# EAGLE schematic MOD-v2-3a (EAGLE 8.3.1)
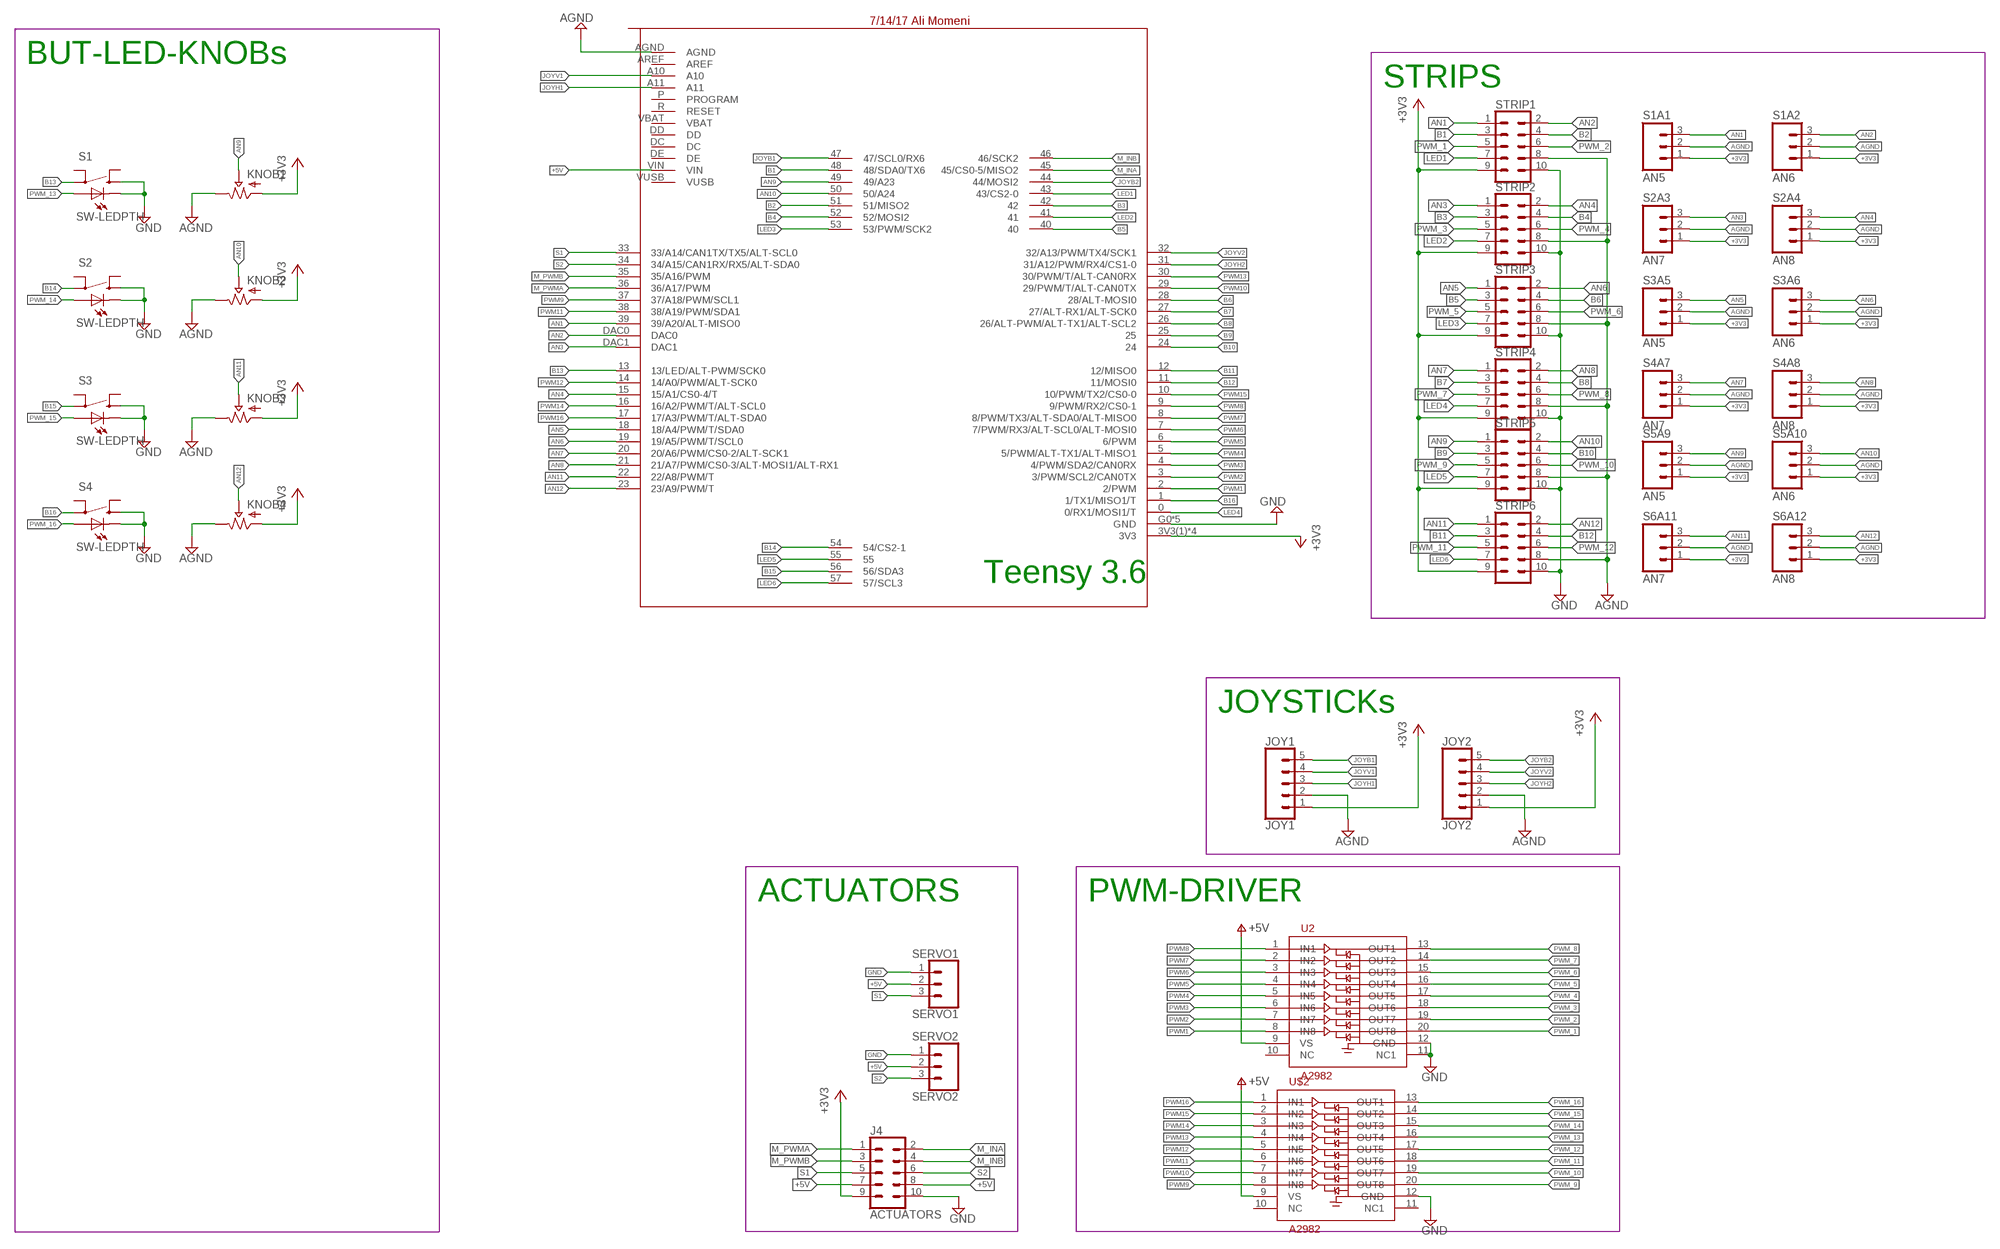
[diagram p0: schematic, sheet 1, part 1 of 2]
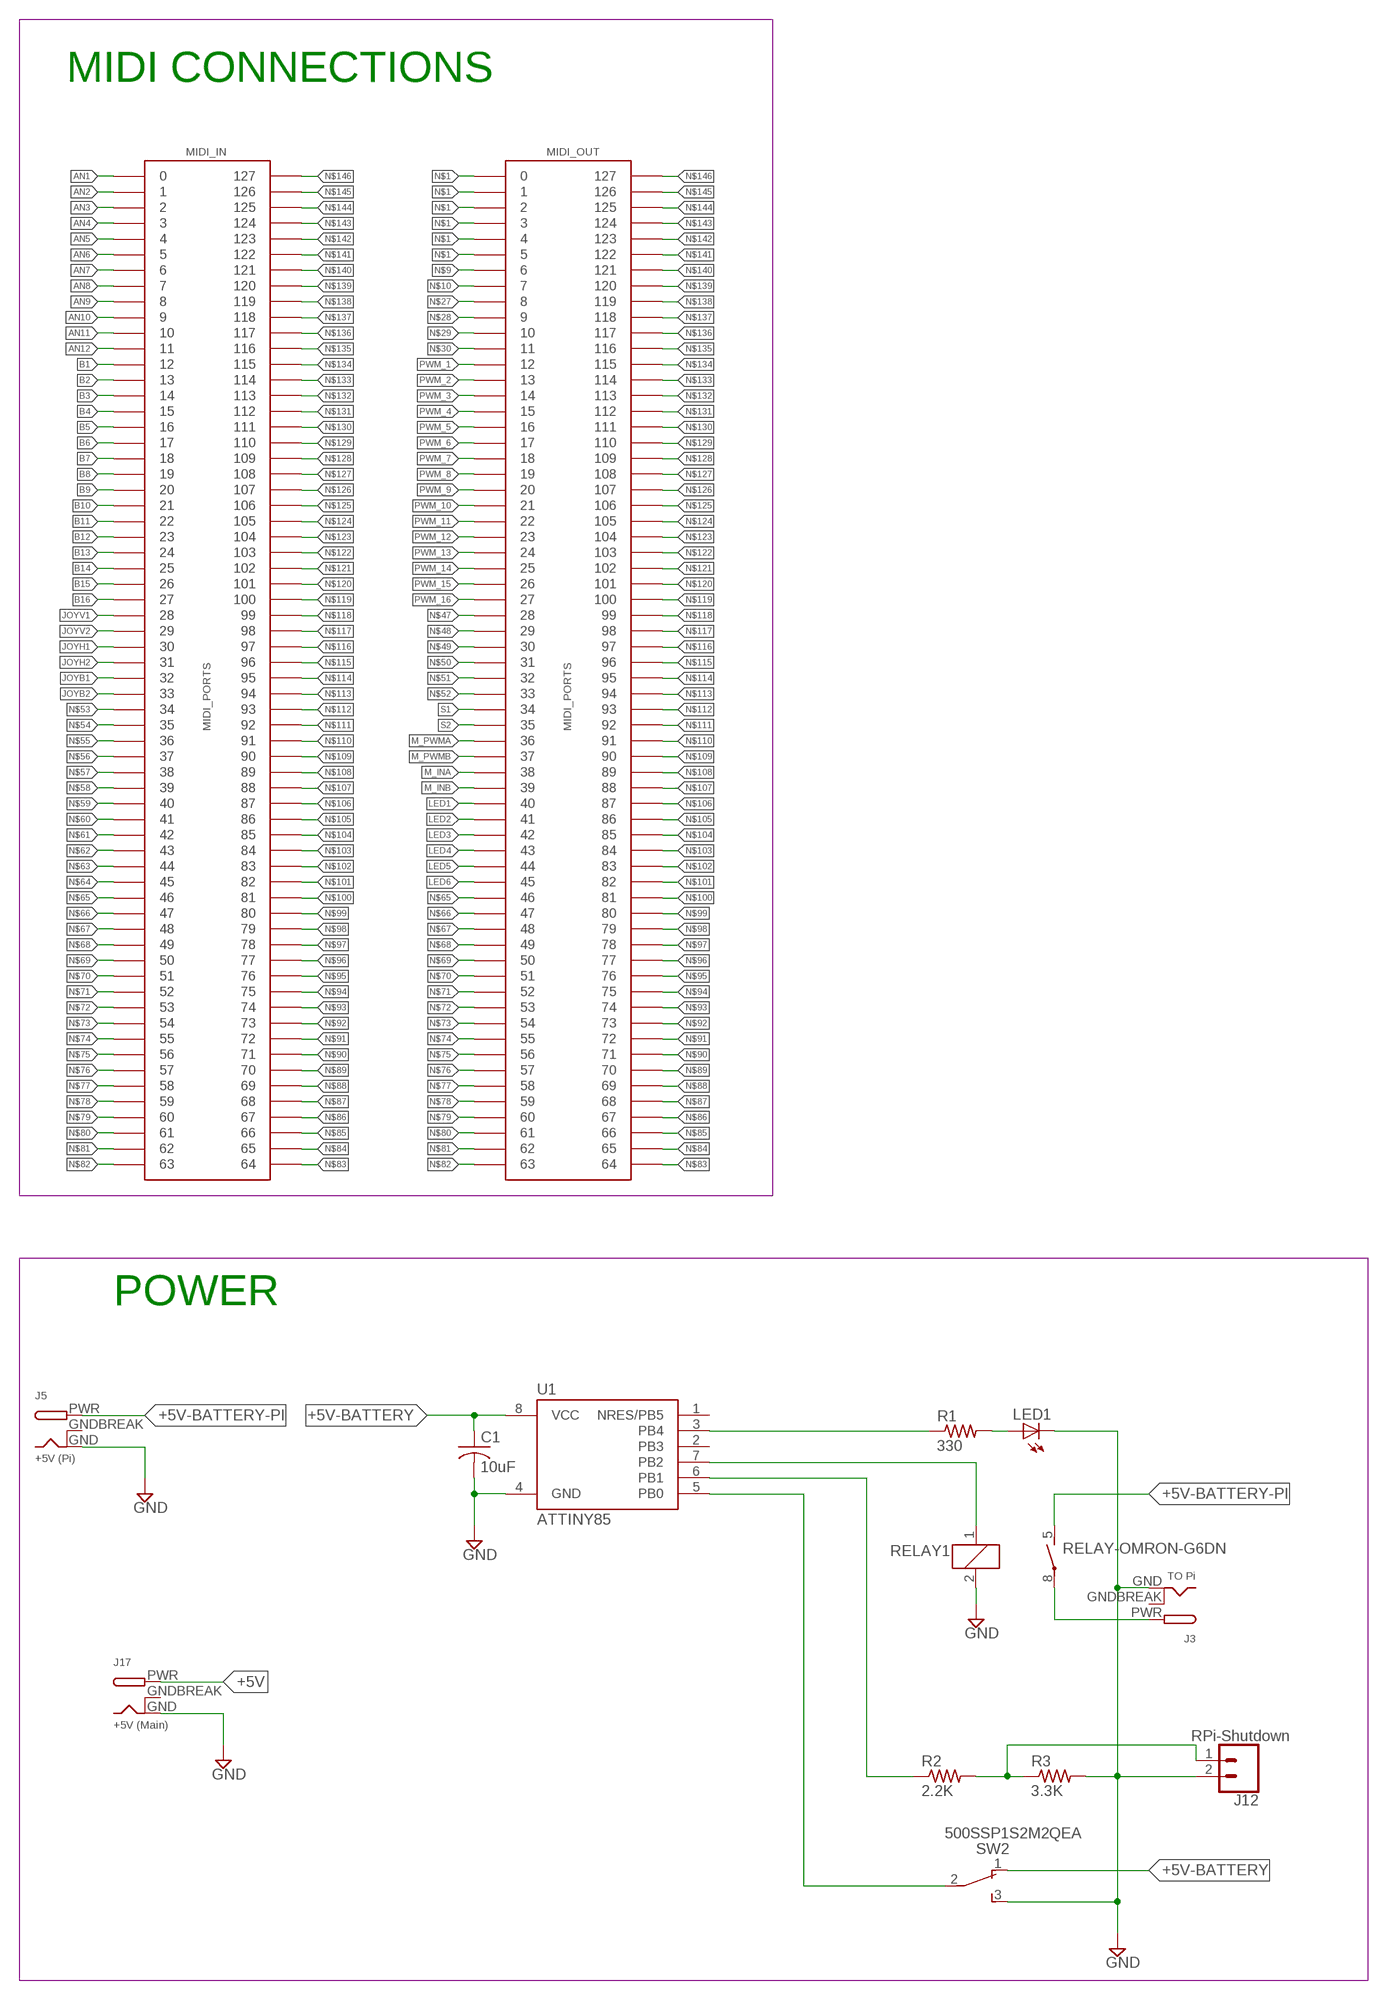
[diagram p1: schematic, sheet 1, part 2 of 2]

## Parts
C1  10uF  C-USC0805  [C0805]
J3  TO Pi  DCBARRELPTH  [DCJACK_2MM_PTH]
J4  ACTUATORS  CONN_05X2SHD_LOCK  [2X5-SHROUDED_LOCK]
J5  +5V (Pi)  DCBARRELPTH  [DCJACK_2MM_PTH]
J12  RPi-Shutdown  CONN_02LOCK  [1X02_LOCK]
J17  +5V (Main)  DCBARRELPTH  [DCJACK_2MM_PTH]
JOY1  JOY1  CONN_05LOCK  [1X05_LOCK]
JOY2  JOY2  CONN_05LOCK  [1X05_LOCK]
KNOB1  POTALPHA_RD901  [POT_ALPHA_RD901F-40-(L)R1]
KNOB2  POTALPHA_RD901  [POT_ALPHA_RD901F-40-(L)R1]
KNOB3  POTALPHA_RD901  [POT_ALPHA_RD901F-40-(L)R1]
KNOB4  POTALPHA_RD901  [POT_ALPHA_RD901F-40-(L)R1]
LED1  LED3MM  [LED3MM]
MIDI_IN  MIDI_PORTS  (no package)
MIDI_OUT  MIDI_PORTS  (no package)
R1  330  R-US_M0805  [M0805]
R2  2.2K  R-US_M0805  [M0805]
R3  3.3K  R-US_M0805  [M0805]
RELAY1  RELAY-OMRON-G6DN  [G6DN-1A]
S1  SW-LEDPTH  [SWITCH_TR2-MOMENTARY-LED]
S1A1  AN5  M03LOCK  [1X03_LOCK]
S1A2  AN6  M03LOCK  [1X03_LOCK]
S2  SW-LEDPTH  [SWITCH_TR2-MOMENTARY-LED]
S2A3  AN7  M03LOCK  [1X03_LOCK]
S2A4  AN8  M03LOCK  [1X03_LOCK]
S3  SW-LEDPTH  [SWITCH_TR2-MOMENTARY-LED]
S3A5  AN5  M03LOCK  [1X03_LOCK]
S3A6  AN6  M03LOCK  [1X03_LOCK]
S4  SW-LEDPTH  [SWITCH_TR2-MOMENTARY-LED]
S4A7  AN7  M03LOCK  [1X03_LOCK]
S4A8  AN8  M03LOCK  [1X03_LOCK]
S5A9  AN5  M03LOCK  [1X03_LOCK]
S5A10  AN6  M03LOCK  [1X03_LOCK]
S6A11  AN7  M03LOCK  [1X03_LOCK]
S6A12  AN8  M03LOCK  [1X03_LOCK]
SERVO1  SERVO1  CONN_03LOCK  [1X03_LOCK@1]
SERVO2  SERVO2  CONN_03LOCK  [1X03_LOCK@1]
STRIP1  CONN_05X2SHD_LOCK  [2X5-SHROUDED_LOCK]
STRIP2  CONN_05X2SHD_LOCK  [2X5-SHROUDED_LOCK]
STRIP3  CONN_05X2SHD_LOCK  [2X5-SHROUDED_LOCK]
STRIP4  CONN_05X2SHD_LOCK  [2X5-SHROUDED_LOCK]
STRIP5  CONN_05X2SHD_LOCK  [2X5-SHROUDED_LOCK]
STRIP6  CONN_05X2SHD_LOCK  [2X5-SHROUDED_LOCK]
SW2  500SSP1S2M2QEA  SWITCH_SPDT500SSP1S2M2QEA  [SWITCH_SPDT_500SSP1S2M2QEA]
TEENSY  TEENSY3_6-ALI_NO-USB-HOST  [TEENSY3-6_NO-USB-HOST]
U1  ATTINY85  ATTINY85SU  [ATTINY85]
U2  A2982  [SOIC20]
U$2  A2982  [SOIC20]

## Nets
+3V3: J4.9 JOY1.1 JOY2.1 KNOB1.1(IN) KNOB2.1(IN) KNOB3.1(IN) KNOB4.1(IN) S1A1.1 S1A2.1 S2A3.1 S2A4.1 S3A5.1 S3A6.1 S4A7.1 S4A8.1 S5A9.1 S5A10.1 S6A11.1 S6A12.1 STRIP1.9 STRIP2.9 STRIP3.9 STRIP4.9 STRIP5.9 STRIP6.9 TEENSY.3V3(1)(3V3) TEENSY.3V3(2)(3V3) TEENSY.3V3(3)(3V3) TEENSY.3V3(4)(3V3)
+5V [Power]: J4.7 J4.8 J17.PWR R1.1 SERVO1.2 SERVO2.2 TEENSY.VIN U1.3(PB4) U2.9(VS) U$2.9(VS) ; supply symbol labelled V+
+5V-BATTERY: C1.1 SW2.1 U1.8(VCC)
+5V-BATTERY-PI: J5.PWR RELAY1.5
AGND [Analog Sig]: JOY1.2 JOY2.2 KNOB1.3(OUT) KNOB2.3(OUT) KNOB3.3(OUT) KNOB4.3(OUT) S1A1.2 S1A2.2 S2A3.2 S2A4.2 S3A5.2 S3A6.2 S4A7.2 S4A8.2 S5A9.2 S5A10.2 S6A11.2 S6A12.2 STRIP1.8 STRIP2.8 STRIP3.8 STRIP4.8 STRIP5.8 STRIP6.8 TEENSY.AGND
AN1 [Analog Sig]: MIDI_IN.0 S1A1.3 STRIP1.1 TEENSY.39(39/A20/ALT-MISO0)
AN2 [Analog Sig]: MIDI_IN.1 S1A2.3 STRIP1.2 TEENSY.DAC0
AN3 [Analog Sig]: MIDI_IN.2 S2A3.3 STRIP2.1 TEENSY.DAC1
AN4 [Analog Sig]: MIDI_IN.3 S2A4.3 STRIP2.2 TEENSY.15(15/A1/CS0-4/T)
AN5 [Analog Sig]: MIDI_IN.4 S3A5.3 STRIP3.1 TEENSY.18(18/A4/PWM/T/SDA0)
AN6 [Analog Sig]: MIDI_IN.5 S3A6.3 STRIP3.2 TEENSY.19(19/A5/PWM/T/SCL0)
AN7 [Analog Sig]: MIDI_IN.6 S4A7.3 STRIP4.1 TEENSY.20(20/A6/PWM/CS0-2/ALT-SCK1)
AN8 [Analog Sig]: MIDI_IN.7 S4A8.3 STRIP4.2 TEENSY.21(21/A7/PWM/CS0-3/ALT-MOSI1/ALT-RX1)
AN9 [Analog Sig]: KNOB1.2(WIPER) MIDI_IN.8 S5A9.3 STRIP5.1 TEENSY.49(49/A23)
AN10 [Analog Sig]: KNOB2.2(WIPER) MIDI_IN.9 S5A10.3 STRIP5.2 TEENSY.50(50/A24)
AN11 [Analog Sig]: KNOB3.2(WIPER) MIDI_IN.10 S6A11.3 STRIP6.1 TEENSY.22(22/A8/PWM/T)
AN12 [Analog Sig]: KNOB4.2(WIPER) MIDI_IN.11 S6A12.3 STRIP6.2 TEENSY.23(23/A9/PWM/T)
B1: MIDI_IN.12 STRIP1.3 TEENSY.48(48/SDA0/TX6)
B2: MIDI_IN.13 STRIP1.4 TEENSY.51(51/MISO2)
B3: MIDI_IN.14 STRIP2.3 TEENSY.42
B4: MIDI_IN.15 STRIP2.4 TEENSY.52(52/MOSI2)
B5: MIDI_IN.16 STRIP3.3 TEENSY.40
B6: MIDI_IN.17 STRIP3.4 TEENSY.28(28/ALT-MOSI0)
B7: MIDI_IN.18 STRIP4.3 TEENSY.27(27/ALT-RX1/ALT-SCK0)
B8: MIDI_IN.19 STRIP4.4 TEENSY.26(26/ALT-PWM/ALT-TX1/ALT-SCL2)
B9: MIDI_IN.20 STRIP5.3 TEENSY.25
B10: MIDI_IN.21 STRIP5.4 TEENSY.24
B11: MIDI_IN.22 STRIP6.3 TEENSY.12(12/MISO0)
B12: MIDI_IN.23 STRIP6.4 TEENSY.11(11/MOSI0)
B13: MIDI_IN.24 S1.3 TEENSY.13(13/LED/ALT-PWM/SCK0)
B14: MIDI_IN.25 S2.3 TEENSY.54(54/CS2-1)
B15: MIDI_IN.26 S3.3 TEENSY.56(56/SDA3)
B16: MIDI_IN.27 S4.3 TEENSY.1(1/TX1/MISO1/T)
GND: C1.2 J3.GND J4.10 J5.GND J12.2 J17.GND LED1.K(C) R3.2 RELAY1.2 S1.1 S1.C S2.1 S2.C S3.1 S3.C S4.1 S4.C SERVO1.1 SERVO2.1 STRIP1.10 STRIP2.10 STRIP3.10 STRIP4.10 STRIP5.10 STRIP6.10 SW2.3 TEENSY.G0(GND) TEENSY.G1(GND) TEENSY.G2(GND) TEENSY.G3(GND) TEENSY.G6(GND) U1.4(GND) U2.11(NC1) U2.12(GND) U$2.12(GND)
JOYB1: JOY1.5 MIDI_IN.32 TEENSY.47(47/SCL0/RX6)
JOYB2: JOY2.5 MIDI_IN.33 TEENSY.44(44/MOSI2)
JOYH1 [Analog Sig]: JOY1.3 MIDI_IN.30 TEENSY.A11
JOYH2 [Analog Sig]: JOY2.3 MIDI_IN.31 TEENSY.31(31/A12/PWM/RX4/CS1-0)
JOYV1 [Analog Sig]: JOY1.4 MIDI_IN.28 TEENSY.A10
JOYV2 [Analog Sig]: JOY2.4 MIDI_IN.29 TEENSY.32(32/A13/PWM/TX4/SCK1)
LED1: MIDI_OUT.40 STRIP1.7 TEENSY.43(43/CS2-0)
LED2: MIDI_OUT.41 STRIP2.7 TEENSY.41
LED3: MIDI_OUT.42 STRIP3.7 TEENSY.53(53/PWM/SCK2)
LED4: MIDI_OUT.43 STRIP4.7 TEENSY.0(0/RX1/MOSI1/T)
LED5: MIDI_OUT.44 STRIP5.7 TEENSY.55
LED6: MIDI_OUT.45 STRIP6.7 TEENSY.57(57/SCL3)
M_INA: J4.2 MIDI_OUT.38 TEENSY.45(45/CS0-5/MISO2)
M_INB: J4.4 MIDI_OUT.39 TEENSY.46(46/SCK2)
M_PWMA: J4.1 MIDI_OUT.36 TEENSY.36(36/A17/PWM)
M_PWMB: J4.3 MIDI_OUT.37 TEENSY.35(35/A16/PWM)
N$1: MIDI_OUT.0 MIDI_OUT.1 MIDI_OUT.2 MIDI_OUT.3 MIDI_OUT.4 MIDI_OUT.5
N$2: LED1.A R1.2
N$3: SW2.2 U1.5(PB0)
N$4: RELAY1.1 U1.7(PB2)
N$5: J12.1 R2.2 R3.1
N$6: J3.PWR RELAY1.8
N$9: MIDI_OUT.6
N$10: MIDI_OUT.7
N$27: MIDI_OUT.8
N$28: MIDI_OUT.9
N$29: MIDI_OUT.10
N$30: MIDI_OUT.11
N$47: MIDI_OUT.28
N$48: MIDI_OUT.29
N$49: MIDI_OUT.30
N$50: MIDI_OUT.31
N$51: MIDI_OUT.32
N$52: MIDI_OUT.33
N$53: MIDI_IN.34
N$54: MIDI_IN.35
N$55: MIDI_IN.36
N$56: MIDI_IN.37
N$57: MIDI_IN.38
N$58: MIDI_IN.39
N$59: MIDI_IN.40
N$60: MIDI_IN.41
N$61: MIDI_IN.42
N$62: MIDI_IN.43
N$63: MIDI_IN.44
N$64: MIDI_IN.45
N$65: MIDI_IN.46 MIDI_OUT.46
N$66: MIDI_IN.47 MIDI_OUT.47
N$67: MIDI_IN.48 MIDI_OUT.48
N$68: MIDI_IN.49 MIDI_OUT.49
N$69: MIDI_IN.50 MIDI_OUT.50
N$70: MIDI_IN.51 MIDI_OUT.51
N$71: MIDI_IN.52 MIDI_OUT.52
N$72: MIDI_IN.53 MIDI_OUT.53
N$73: MIDI_IN.54 MIDI_OUT.54
N$74: MIDI_IN.55 MIDI_OUT.55
N$75: MIDI_IN.56 MIDI_OUT.56
N$76: MIDI_IN.57 MIDI_OUT.57
N$77: MIDI_IN.58 MIDI_OUT.58
N$78: MIDI_IN.59 MIDI_OUT.59
N$79: MIDI_IN.60 MIDI_OUT.60
N$80: MIDI_IN.61 MIDI_OUT.61
N$81: MIDI_IN.62 MIDI_OUT.62
N$82: MIDI_IN.63 MIDI_OUT.63
N$83: MIDI_IN.64 MIDI_OUT.64
N$84: MIDI_IN.65 MIDI_OUT.65
N$85: MIDI_IN.66 MIDI_OUT.66
N$86: MIDI_IN.67 MIDI_OUT.67
N$87: MIDI_IN.68 MIDI_OUT.68
N$88: MIDI_IN.69 MIDI_OUT.69
N$89: MIDI_IN.70 MIDI_OUT.70
N$90: MIDI_IN.71 MIDI_OUT.71
N$91: MIDI_IN.72 MIDI_OUT.72
N$92: MIDI_IN.73 MIDI_OUT.73
N$93: MIDI_IN.74 MIDI_OUT.74
N$94: MIDI_IN.75 MIDI_OUT.75
N$95: MIDI_IN.76 MIDI_OUT.76
N$96: MIDI_IN.77 MIDI_OUT.77
N$97: MIDI_IN.78 MIDI_OUT.78
N$98: MIDI_IN.79 MIDI_OUT.79
N$99: MIDI_IN.80 MIDI_OUT.80
N$100: MIDI_IN.81 MIDI_OUT.81
N$101: MIDI_IN.82 MIDI_OUT.82
N$102: MIDI_IN.83 MIDI_OUT.83
N$103: MIDI_IN.84 MIDI_OUT.84
N$104: MIDI_IN.85 MIDI_OUT.85
N$105: MIDI_IN.86 MIDI_OUT.86
N$106: MIDI_IN.87 MIDI_OUT.87
N$107: MIDI_IN.88 MIDI_OUT.88
N$108: MIDI_IN.89 MIDI_OUT.89
N$109: MIDI_IN.90 MIDI_OUT.90
N$110: MIDI_IN.91 MIDI_OUT.91
N$111: MIDI_IN.92 MIDI_OUT.92
N$112: MIDI_IN.93 MIDI_OUT.93
N$113: MIDI_IN.94 MIDI_OUT.94
N$114: MIDI_IN.95 MIDI_OUT.95
N$115: MIDI_IN.96 MIDI_OUT.96
N$116: MIDI_IN.97 MIDI_OUT.97
N$117: MIDI_IN.98 MIDI_OUT.98
N$118: MIDI_IN.99 MIDI_OUT.99
N$119: MIDI_IN.100 MIDI_OUT.100
N$120: MIDI_IN.101 MIDI_OUT.101
N$121: MIDI_IN.102 MIDI_OUT.102
N$122: MIDI_IN.103 MIDI_OUT.103
N$123: MIDI_IN.104 MIDI_OUT.104
N$124: MIDI_IN.105 MIDI_OUT.105
N$125: MIDI_IN.106 MIDI_OUT.106
N$126: MIDI_IN.107 MIDI_OUT.107
N$127: MIDI_IN.108 MIDI_OUT.108
N$128: MIDI_IN.109 MIDI_OUT.109
N$129: MIDI_IN.110 MIDI_OUT.110
N$130: MIDI_IN.111 MIDI_OUT.111
N$131: MIDI_IN.112 MIDI_OUT.112
N$132: MIDI_IN.113 MIDI_OUT.113
N$133: MIDI_IN.114 MIDI_OUT.114
N$134: MIDI_IN.115 MIDI_OUT.115
N$135: MIDI_IN.116 MIDI_OUT.116
N$136: MIDI_IN.117 MIDI_OUT.117
N$137: MIDI_IN.118 MIDI_OUT.118
N$138: MIDI_IN.119 MIDI_OUT.119
N$139: MIDI_IN.120 MIDI_OUT.120
N$140: MIDI_IN.121 MIDI_OUT.121
N$141: MIDI_IN.122 MIDI_OUT.122
N$142: MIDI_IN.123 MIDI_OUT.123
N$143: MIDI_IN.124 MIDI_OUT.124
N$144: MIDI_IN.125 MIDI_OUT.125
N$145: MIDI_IN.126 MIDI_OUT.126
N$146: MIDI_IN.127 MIDI_OUT.127
PI-REST: R2.1 U1.6(PB1)
PWM1: TEENSY.2(2/PWM) U2.8(IN8)
PWM2: TEENSY.3(3/PWM/SCL2/CAN0TX) U2.7(IN7)
PWM3: TEENSY.4(4/PWM/SDA2/CAN0RX) U2.6(IN6)
PWM4: TEENSY.5(5/PWM/ALT-TX1/ALT-MISO1) U2.5(IN5)
PWM5: TEENSY.6(6/PWM) U2.4(IN4)
PWM6: TEENSY.7(7/PWM/RX3/ALT-SCL0/ALT-MOSI0) U2.3(IN3)
PWM7: TEENSY.8(8/PWM/TX3/ALT-SDA0/ALT-MISO0) U2.2(IN2)
PWM8: TEENSY.9(9/PWM/RX2/CS0-1) U2.1(IN1)
PWM9: TEENSY.37(37/A18/PWM/SCL1) U$2.8(IN8)
PWM10: TEENSY.29(29/PWM/T/ALT-CAN0TX) U$2.7(IN7)
PWM11: TEENSY.38(38/A19/PWM/SDA1) U$2.6(IN6)
PWM12: TEENSY.14(14/A0/PWM/ALT-SCK0) U$2.5(IN5)
PWM13: TEENSY.30(30/PWM/T/ALT-CAN0RX) U$2.4(IN4)
PWM14: TEENSY.16(16/A2/PWM/T/ALT-SCL0) U$2.3(IN3)
PWM15: TEENSY.10(10/PWM/TX2/CS0-0) U$2.2(IN2)
PWM16: TEENSY.17(17/A3/PWM/T/ALT-SDA0) U$2.1(IN1)
PWM_1: MIDI_OUT.12 STRIP1.5 U2.20(OUT8)
PWM_2: MIDI_OUT.13 STRIP1.6 U2.19(OUT7)
PWM_3: MIDI_OUT.14 STRIP2.5 U2.18(OUT6)
PWM_4: MIDI_OUT.15 STRIP2.6 U2.17(OUT5)
PWM_5: MIDI_OUT.16 STRIP3.5 U2.16(OUT4)
PWM_6: MIDI_OUT.17 STRIP3.6 U2.15(OUT3)
PWM_7: MIDI_OUT.18 STRIP4.5 U2.14(OUT2)
PWM_8: MIDI_OUT.19 STRIP4.6 U2.13(OUT1)
PWM_9: MIDI_OUT.20 STRIP5.5 U$2.20(OUT8)
PWM_10: MIDI_OUT.21 STRIP5.6 U$2.19(OUT7)
PWM_11: MIDI_OUT.22 STRIP6.5 U$2.18(OUT6)
PWM_12: MIDI_OUT.23 STRIP6.6 U$2.17(OUT5)
PWM_13: MIDI_OUT.24 S1.A U$2.16(OUT4)
PWM_14: MIDI_OUT.25 S2.A U$2.15(OUT3)
PWM_15: MIDI_OUT.26 S3.A U$2.14(OUT2)
PWM_16: MIDI_OUT.27 S4.A U$2.13(OUT1)
S1: J4.5 MIDI_OUT.34 SERVO1.3 TEENSY.33(33/A14/CAN1TX/TX5/ALT-SCL0)
S2: J4.6 MIDI_OUT.35 SERVO2.3 TEENSY.34(34/A15/CAN1RX/RX5/ALT-SDA0)
Unconnected: S1.2 S1.4 S2.2 S2.4 S3.2 S3.4 S4.2 S4.4 TEENSY.AREF TEENSY.DC TEENSY.DD TEENSY.DE TEENSY.P(PROGRAM) TEENSY.R(RESET) TEENSY.VBAT TEENSY.VUSB U1.1(NRES/PB5) U1.2(PB3) U2.10(NC) U$2.10(NC) U$2.11(NC1)

## Notes on the sheet
- BUT-LED-KNOBs
- STRIPS
- MIDI CONNECTIONS
- Teensy 3.6
- JOYSTICKs
- ACTUATORS | PWM-DRIVER
- POWER

## Power pins joined to a net without a drawn wire
GNDBREAK: J3.GNDBREAK J5.GNDBREAK J17.GNDBREAK

## Library data of the parts
C1 = resistor:C-US: CAPACITOR, American symbol
J3 J5 J17 = adafruit:DCBARREL: 2.0mm DC Barrel Jack DCJACK_2MM_PTH - Through Hole Jack (4UConnector: 05537)
J4 STRIP1-STRIP6 = SparkFun-Connectors:CONN_05X2: Multi connection point. Often used as Generic Header-pin footprint for 0.1 inch spaced/style header connections For AVR SPI programming port, see special device with nice symbol: "AVR_SPI_PROG_5x2.dev" You can populate with any combo of single row headers, but if you'd like an exact match, check these: 2x5 AVR ICSP Male Header <https://www.sparkfun.com/products/778> (PRT-00778) 2x5 Pin Shrouded Header <https://www.sparkfun.com/products/8506> (PRT-08506) On any of the 0.1 inch spaced packages, you can populate with these: Break Away Headers - Straight <https://www.sparkfun.com/products/116> (PRT-00116) Break Away Male Headers - Right Angle <https://www.sparkfun.com/products/553> (PRT-00553) Female Headers <https://www.sparkfun.com/products/115> (PRT-00115) Break Away Headers - Machine Pin <https://www.sparkfun.com/products/117> (PRT-00117) Break Away Female Headers - Swiss Machine Pin <https://www.sparkfun.com/products/743> (PRT-00743) Special note: the shrouded connector mates well with our 5x2 ribbon cables: 2x5 Pin IDC Ribbon Cable <https://www.sparkfun.com/products/8535> (PRT-08535); PROD_ID: CONN-08671; SF_ID: PRT-08506
J12 = SparkFun-Connectors:CONN_02: Multi connection point. Often used as Generic Header-pin footprint for 0.1 inch spaced/style header connections On any of the 0.1 inch spaced packages, you can populate with these: Break Away Headers - Straight <https://www.sparkfun.com/products/116> (PRT-00116) Break Away Male Headers - Right Angle <https://www.sparkfun.com/products/553> (PRT-00553) Female Headers <https://www.sparkfun.com/products/115> (PRT-00115) Break Away Headers - Machine Pin <https://www.sparkfun.com/products/117> (PRT-00117) Break Away Female Headers - Swiss Machine Pin <https://www.sparkfun.com/products/743> (PRT-00743) For SCREWTERMINALS and SPRING TERMINALS visit here: Screw Terimnals on SparkFun.com <https://www.sparkfun.com/search/results?term=Screw+Terminals> (5mm/3.5mm/2.54mm spacing) This device is also useful as a general connection point to wire up your design to another part of your project. Our various solder wires solder well into these plated through hole pads. Hook-Up Wire - Assortment (Stranded, 22 AWG) <https://www.sparkfun.com/products/11375> (PRT-11375) Hook-Up Wire - Assortment (Solid Core, 22 AWG) <https://www.sparkfun.com/products/11367> (PRT-11367) View the entire wire category on our website here <https://www.sparkfun.com/categories/141> Special notes: Molex polarized connector foot print use with: PRT-08233 with associated crimp pins and housings. 2.54_SCREWTERM for use with PRT-10571. 3.5mm Screw Terminal footprints for PRT-08084 5mm Screw Terminal footprints for use with PRT-08432
JOY1 JOY2 = SparkFun-Connectors:CONN_05: Multi connection point. Often used as Generic Header-pin footprint for 0.1 inch spaced/style header connections On any of the 0.1 inch spaced packages, you can populate with these: Break Away Headers - Straight <https://www.sparkfun.com/products/116> (PRT-00116) Break Away Male Headers - Right Angle <https://www.sparkfun.com/products/553> (PRT-00553) Female Headers <https://www.sparkfun.com/products/115> (PRT-00115) Break Away Headers - Machine Pin <https://www.sparkfun.com/products/117> (PRT-00117) Break Away Female Headers - Swiss Machine Pin <https://www.sparkfun.com/products/743> (PRT-00743) For SCREWTERMINALS and SPRING TERMINALS visit here: Screw Terimnals on SparkFun.com <https://www.sparkfun.com/search/results?term=Screw+Terminals> (5mm/3.5mm/2.54mm spacing) This device is also useful as a general connection point to wire up your design to another part of your project. Our various solder wires solder well into these plated through hole pads. Hook-Up Wire - Assortment (Stranded, 22 AWG) <https://www.sparkfun.com/products/11375> (PRT-11375) Hook-Up Wire - Assortment (Solid Core, 22 AWG) <https://www.sparkfun.com/products/11367> (PRT-11367) View the entire wire category on our website here <https://www.sparkfun.com/categories/141> Special notes: Molex polarized connector foot print use with SKU : PRT-08231 with associated crimp pins and housings. 1MM SMD Version SKU: PRT-10208
KNOB1-KNOB4 = CMU-ArtFab:POT: http://www.taydaelectronics.com/10k-ohm-linear-taper-potentiometer-round-shaft-pcb-9mm.html http://www.taydaelectronics.com/datasheets/A-1847.pdf
LED1 = led:LED: LED OSRAM: - CHIPLED LG R971, LG N971, LY N971, LG Q971, LY Q971, LO R971, LY R971 LH N974, LH R974 LS Q976, LO Q976, LY Q976 LO Q996 - Hyper CHIPLED LW Q18S LB Q993, LB Q99A, LB R99A - SideLED LS A670, LO A670, LY A670, LG A670, LP A670 LB A673, LV A673, LT A673, LW A673 LH A674 LY A675 LS A676, LA A676, LO A676, LY A676, LW A676 LS A679, LY A679, LG A679 - Hyper Micro SIDELED® LS Y876, LA Y876, LO Y876, LY Y876 LT Y87S - SmartLED LW L88C, LW L88S LB L89C, LB L89S, LG L890 LS L89K, LO L89K, LY L89K LS L896, LA L896, LO L896, LY L896 - TOPLED LS T670, LO T670, LY T670, LG T670, LP T670 LSG T670, LSP T670, LSY T670, LOP T670, LYG T670 LG T671, LOG T671, LSG T671 LB T673, LV T673, LT T673, LW T673 LH T674 LS T676, LA T676, LO T676, LY T676, LB T676, LH T676, LSB T676, LW T676 LB T67C, LV T67C, LT T67C, LS T67K, LO T67K, LY T67K, LW E67C LS E67B, LA E67B, LO E67B, LY E67B, LB E67C, LV E67C, LT E67C LW T67C LS T679, LY T679, LG T679 LS T770, LO T770, LY T770, LG T770, LP T770 LB T773, LV T773, LT T773, LW T773 LH T774 LS E675, LA E675, LY E675, LS T675 LS T776, LA T776, LO T776, LY T776, LB T776 LHGB T686 LT T68C, LB T68C - Hyper Mini TOPLED® LB M676 - Mini TOPLED Santana® LG M470 LS M47K, LO M47K, LY M47K Source: http://www.osram.convergy.de LUXEON: - LUMILED® LXK2-PW12-R00, LXK2-PW12-S00, LXK2-PW14-U00, LXK2-PW14-V00 LXK2-PM12-R00, LXK2-PM12-S00, LXK2-PM14-U00 LXK2-PE12-Q00, LXK2-PE12-R00, LXK2-PE12-S00, LXK2-PE14-T00, LXK2-PE14-U00 LXK2-PB12-K00, LXK2-PB12-L00, LXK2-PB12-M00, LXK2-PB14-N00, LXK2-PB14-P00, LXK2-PB14-Q00 LXK2-PR12-L00, LXK2-PR12-M00, LXK2-PR14-Q00, LXK2-PR14-R00 LXK2-PD12-Q00, LXK2-PD12-R00, LXK2-PD12-S00 LXK2-PH12-R00, LXK2-PH12-S00 LXK2-PL12-P00, LXK2-PL12-Q00, LXK2-PL12-R00 Source: www.luxeon.com KINGBRIGHT: KA-3528ASYC Source: www.kingbright.com
MIDI_IN MIDI_OUT = CMU-ArtFab:MIDI_PORTS
R1-R3 = rcl:R-US_: RESISTOR, American symbol
RELAY1 = CMU-ArtFab:RELAY-OMRON-G6DN
S1-S4 = CMU-ArtFab:SW-LED: SWITCH PUSH SPST-NO 10MA 12V
S1A1 S1A2 S2A3 S2A4 S3A5 S3A6 S4A7 S4A8 S5A9 S5A10 S6A11 S6A12 = SparkFun-Connectors:M03: Header 3 Standard 3-pin 0.1" header. Use with straight break away headers (SKU : PRT-00116), right angle break away headers (PRT-00553), swiss pins (PRT-00743), machine pins (PRT-00117), and female headers (PRT-00115). Molex polarized connector foot print use with SKU : PRT-08232 with associated crimp pins and housings.
SERVO1 SERVO2 = SparkFun-Connectors:CONN_03: Multi connection point. Often used as Generic Header-pin footprint for 0.1 inch spaced/style header connections On any of the 0.1 inch spaced packages, you can populate with these: Break Away Headers - Straight <https://www.sparkfun.com/products/116> (PRT-00116) Break Away Male Headers - Right Angle <https://www.sparkfun.com/products/553> (PRT-00553) Female Headers <https://www.sparkfun.com/products/115> (PRT-00115) Break Away Headers - Machine Pin <https://www.sparkfun.com/products/117> (PRT-00117) Break Away Female Headers - Swiss Machine Pin <https://www.sparkfun.com/products/743> (PRT-00743) Stackable Header - 3 Pin (Female, 0.1") <https://www.sparkfun.com/products/13875> (PRT-13875) For SCREWTERMINALS and SPRING TERMINALS visit here: Screw Terimnals on SparkFun.com <https://www.sparkfun.com/search/results?term=Screw+Terminals> (5mm/3.5mm/2.54mm spacing) This device is also useful as a general connection point to wire up your design to another part of your project. Our various solder wires solder well into these plated through hole pads. Hook-Up Wire - Assortment (Stranded, 22 AWG) <https://www.sparkfun.com/products/11375> (PRT-11375) Hook-Up Wire - Assortment (Solid Core, 22 AWG) <https://www.sparkfun.com/products/11367> (PRT-11367) View the entire wire category on our website here <https://www.sparkfun.com/categories/141> Special notes: Molex polarized connector foot print use with SKU : PRT-08232 with associated crimp pins and housings.
SW2 = CMU-ArtFab:SWITCH_SPDT; DIGIKEY: EG5137-ND
TEENSY = CMU-ArtFab:TEENSY3_6-ALI_NO-USB-HOST
U1 = attiny85:ATTINY85: ATMEL ATtiny 85
U2 U$2 = CMU-ArtFab:A2982

## Net classes
2 Power: width 0.381 mm, clearance 0.279 mm
3 Analog Sig: width 0.381 mm, clearance 0.279 mm